# Altium schematic sheet [12] - CAN & RS232.SchDoc: CAN & RS232
size B; Organization: Altium Limited; Address1: L3, 12a Rodborough Rd; Address2: Frenchs Forest; Address3: NSW; Address4: Australia 2086; DocumentNumber: 12; Revision: V1I1; SheetNumber: 12; SheetTotal: 16
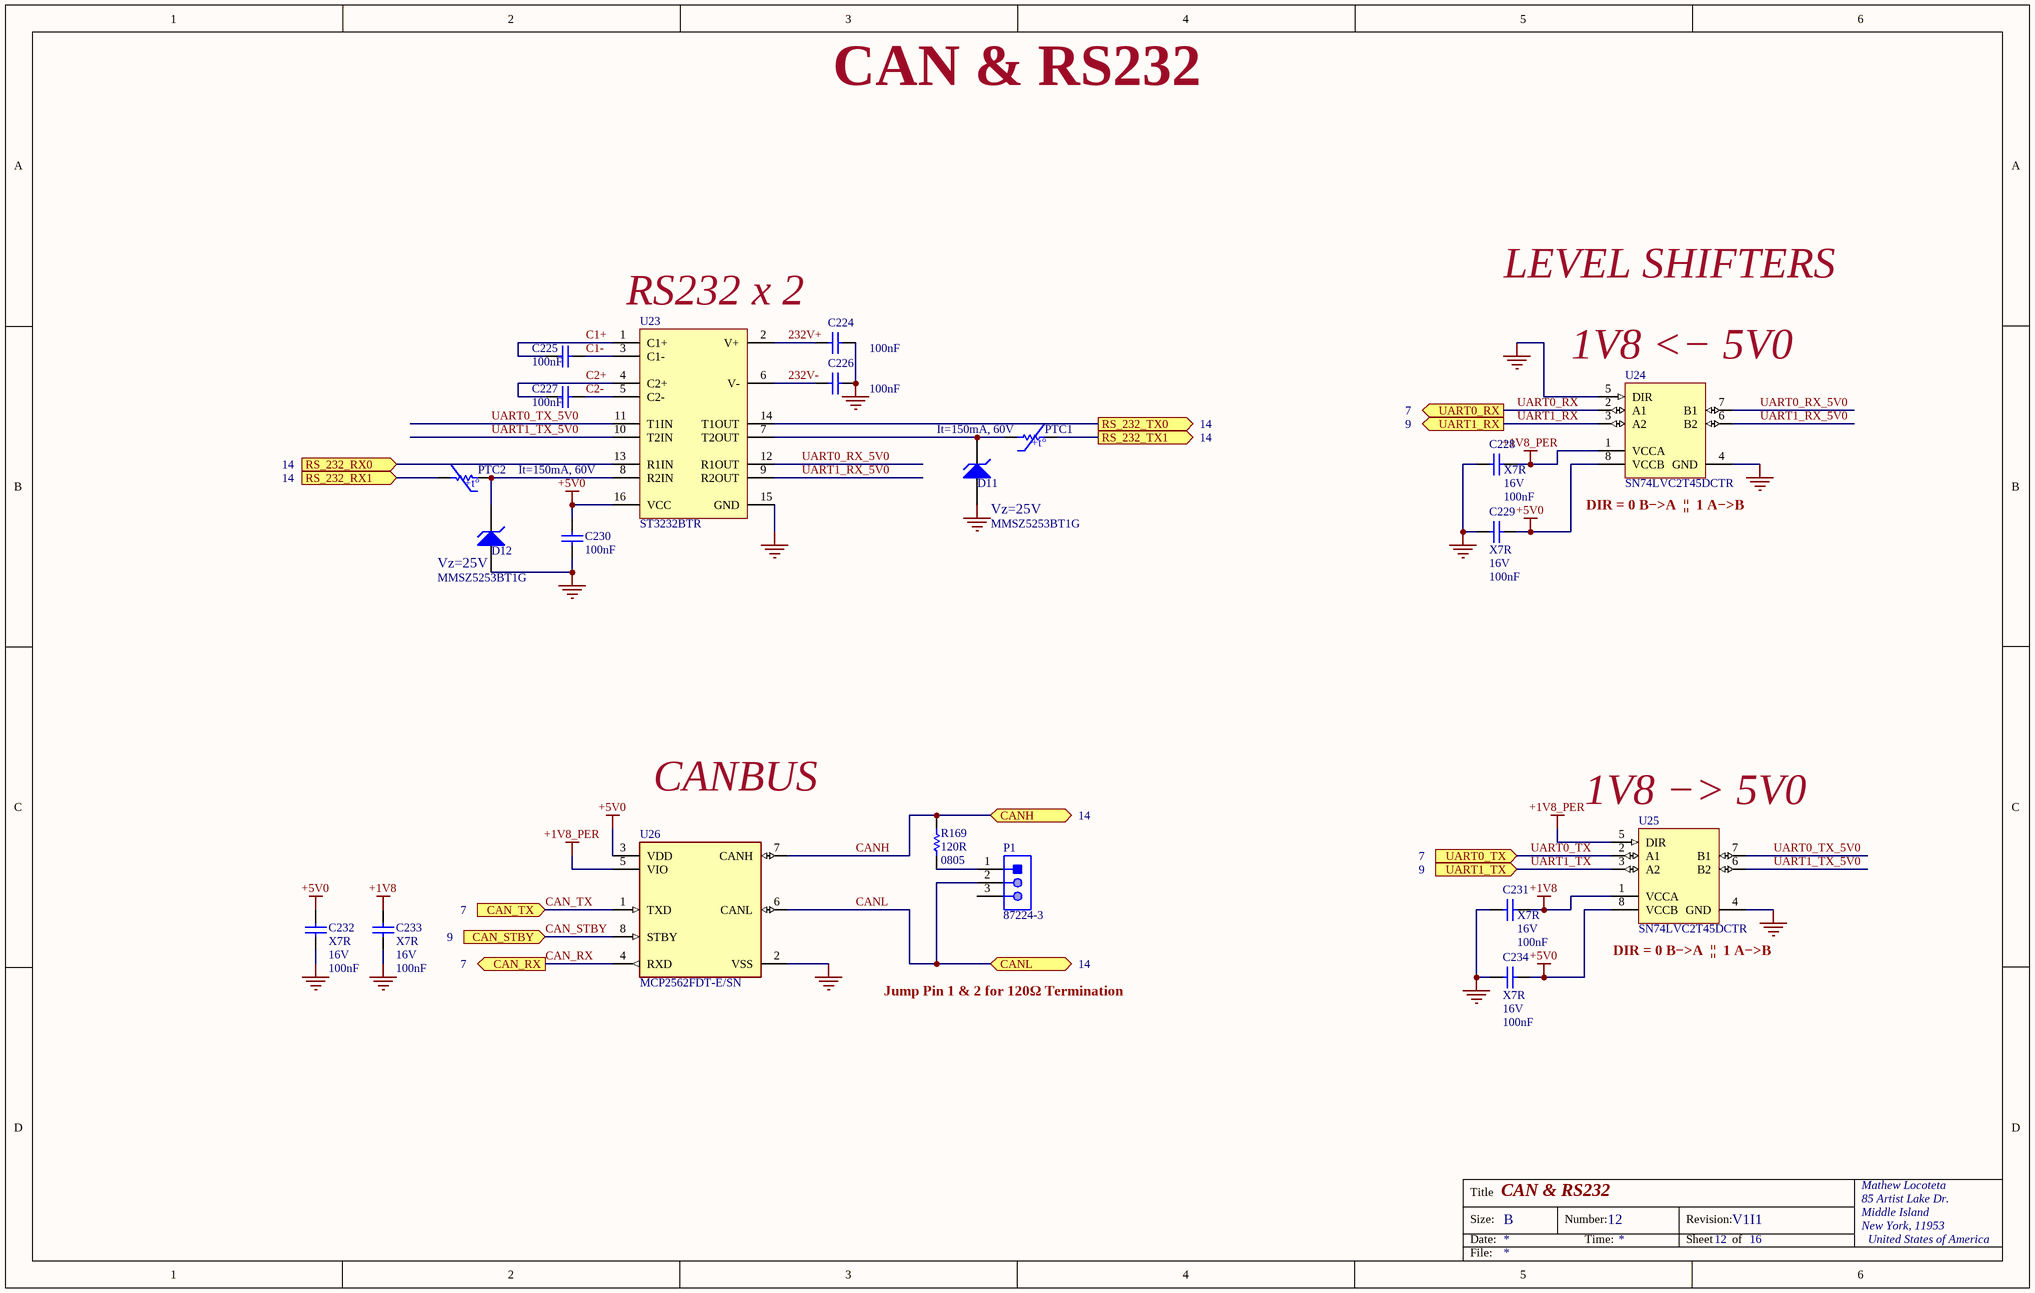
[diagram p0: [12] - CAN & RS232.SchDoc]

## Parts
C224  Capacitance: 100nF  (hidden comment: 100nF 0402 16V)
C225  Capacitance: 100nF  (hidden comment: 100nF 0402 16V)
C226  Capacitance: 100nF  (hidden comment: 100nF 0402 16V)
C227  Capacitance: 100nF  (hidden comment: 100nF 0402 16V)
C228  Dielectric: X7R  Voltage Rating: 16V  Capacitance: 100nF  (hidden comment: 100nF 0402 16V)
C229  Dielectric: X7R  Voltage Rating: 16V  Capacitance: 100nF  (hidden comment: 100nF 0402 16V)
C230  Capacitance: 100nF  (hidden comment: 100nF 0402 16V)
C231  Dielectric: X7R  Voltage Rating: 16V  Capacitance: 100nF  (hidden comment: 100nF 0402 16V)
C232  Dielectric: X7R  Voltage Rating: 16V  Capacitance: 100nF  (hidden comment: 100nF 0402 16V)
C233  Dielectric: X7R  Voltage Rating: 16V  Capacitance: 100nF  (hidden comment: 100nF 0402 16V)
C234  Dielectric: X7R  Voltage Rating: 16V  Capacitance: 100nF  (hidden comment: 100nF 0402 16V)
D11  MMSZ5253BT1G  [ONSC-SOD-123-2-425-04_V]
D12  MMSZ5253BT1G  [ONSC-SOD-123-2-425-04_V]
P1  87224-3  [TECO-87224-3_V]
PTC1  It=150mA, 60V  [R1206]
PTC2  It=150mA, 60V  [R1206]
R169  value 120R  Case: 0805  [RESC2013X50X30LL20T20]  (hidden comment: CRCW0805120RJNEA)
U23  ST3232BTR  [STM-TSSOP-16_L]
U24  SN74LVC2T45DCTR  [DCT0008A_N]
U25  SN74LVC2T45DCTR  [DCT0008A_N]
U26  MCP2562FDT-E/SN  [FP-C04-057-SN-MFG]

## Ports
CAN_RX (out), CAN_STBY (in), CAN_TX (in), CANH (bidir), CANL (bidir), RS_232_RX0 (in), RS_232_RX1 (in), RS_232_TX0 (out), RS_232_TX1 (out), UART0_RX (out), UART0_TX (in), UART1_RX (out), UART1_TX (in)

## Nets
+1V8: C231.1 C233.2 U25.1(VCCA)
+1V8_PER: C228.1 U24.1(VCCA) U25.5(DIR) U26.5(VIO)
+5V0: C229.2 C230.2 C232.2 C234.2 U23.16(VCC) U24.8(VCCB) U25.8(VCCB) U26.3(VDD)
GND: C224.1 C226.1 C228.2 C229.1 C230.1 C231.2 C232.1 C233.1 C234.1 D11.2(A) D12.2(A) U23.15(GND) U24.4(GND) U24.5(DIR) U25.4(GND) U26.2(VSS)
232V+: C224.2 U23.2(V+)
232V-: C226.2 U23.6(V-)
C1+: C225.1 U23.1(C1+)
C1-: C225.2 U23.3(C1-)
C2+: C227.1 U23.4(C2+)
C2-: C227.2 U23.5(C2-)
CAN_RX: U26.4(RXD) ; port CAN_RX
CAN_STBY: U26.8(STBY) ; port CAN_STBY
CAN_TX: U26.1(TXD) ; port CAN_TX
CANH: R169.1 U26.7(CANH) ; port CANH
CANL: P1.2 U26.6(CANL) ; port CANL
RS_232_RX0: U23.13(R1IN) ; port RS_232_RX0
RS_232_RX1: PTC2.2 ; port RS_232_RX1
RS_232_TX0: U23.14(T1OUT) ; port RS_232_TX0
RS_232_TX1: PTC1.2 ; port RS_232_TX1
UART0_RX: U24.2(A1) ; port UART0_RX
UART0_RX_5V0: U23.12(R1OUT) U24.7(B1)
UART0_TX: U25.2(A1) ; port UART0_TX
UART0_TX_5V0: U23.11(T1IN) U25.7(B1)
UART1_RX: U24.3(A2) ; port UART1_RX
UART1_RX_5V0: U23.9(R2OUT) U24.6(B2)
UART1_TX: U25.3(A2) ; port UART1_TX
UART1_TX_5V0: U23.10(T2IN) U25.6(B2)
NetD11_1: D11.1(K) PTC1.1 U23.7(T2OUT)
NetD12_1: D12.1(K) PTC2.1 U23.8(R2IN)
NetP1_1: P1.1 R169.2

Not connected (* = marked no-connect by the designer): P1 3

## Notes on the sheet
- CAN & RS232
- LEVEL SHIFTERS
- RS232 x 2
- (near U24) 1V8 <− 5V0
- 14
- 7
- 9
- (near U24) DIR = 0 B−>A  ||  1 A−>B
- (near D12) Vz=25V
- (near D11) Vz=25V
- CANBUS
- (near U25) 1V8 −> 5V0
- (near U25) DIR = 0 B−>A  ||  1 A−>B
- Jump Pin 1 & 2 for 120Ω Termination
- Title
- Size:
- Date:
- B
- Number:
- Time:
- Revision:
- Sheet
- of
- Mathew Locoteta
- 85 Artist Lake Dr.
- Middle Island
- New York, 11953
- United States of America
- File:
- (in symbol 0ZCJ0005FF2E) +t°

## Library data of the parts
C224-C234 = C0402C104J4RACTU: KEMET - C0402C104J4RACTU - SMD Multilayer Ceramic Capacitor, 0.1 µF, 16 V, 0402 [1005 Metric], ± 5%, X7R, C Series KEMET; Dissipation Factor: 3.5%; Supplier 1: Digi-Key; Manufacturer: KEMET; Manufacturer Part Number: C0402C104J4RACTU; RoHS: Yes; Category: Ceramic Capacitors; Stock 1: 106350; Pricing 1: 1=0.48000, 10=0.33900, 50=0.25620, 100=0.22310, 500=0.16528, 1000=0.14049, 2500=0.13223, 5000=0.12396 (USD); Mount: Surface Mount,PCB; Case/Package: 0402; Case Code (Metric): 1005; Case Code (Imperial): 0402; Dielectric Material: Ceramic; Contact Plating: Tin,Matte; Min Operating Temperature: -55°C; Max Operating Temperature: 125°C; Tolerance: 5%; Packaging: Tape and Reel; Package Quantity: 1; Termination: SMD/SMT; Voltage: 16V; Length: 1mm; Height: 0.5mm; Width: 0.02inch; Thickness: 0.022inch; Depth: 0.5mm; Radiation Hardening: No; REACH SVHC: No SVHC; ComponentLink1URL: https://datasheet.ciiva.com/5415/kem-c1002-x7r-smd-5415819.pdf?src-supplier=Mouser; ComponentLink1Description: https://datasheet.ciiva.com/5415/kem-c1002-x7r-smd-5415819.pdf?src-supplier=Mouser; ComponentLink2URL: https://datasheet.ciiva.com/46424/1851736-46424159.pdf?src-supplier=Element14; ComponentLink2Description: https://datasheet.ciiva.com/46424/1851736-46424159.pdf?src-supplier=Element14; Supplier Part Number 1: 399-7761-1-ND; Voltage Rating (DC): 16V
  C224-C227 C230: Dielectric: X7R; Voltage Rating: 16V
D11 D12 = CMP-1060-00460-1: Zener Voltage Regulator, 500 mW, 2-Pin SOD-123, Pb-Free, Tape and Reel; Manufacturer: On Semiconductor; P Max (W): 0.5; VZ Typ (V): 25; PackageVersion: Rev. G, 10/2009; RoHS: Pb-Free; PartNumber: MMSZ5253BT1G; DatasheetVersion: Rev. 12; PackageReference: SOD-123-2-425-04; ComponentLink2Description: Datasheet; Mounting Technology: Surface Mount; ComponentLink2URL: http://www.onsemi.com/pub_link/Collateral/MMSZ5221BT1-D.PDF; ComponentLink1Description: Manufacturer URL; ComponentLink3Description: Package Specification; ComponentLink3URL: http://www.onsemi.com/pub_link/Collateral/425-04.PDF; Packing: Tape and Reel; ComponentLink1URL: http://www.onsemi.com/; PackageDescription: 2-Pin SOD, Body 1.6 x 2.69 mm
P1 = CMP-2000-05697-1: Male Header, Pitch 2.54 mm, 1 x 3 Position, Height 10.744 mm, Tail Length 3.175 mm, -65 to 105 degC, RoHS, Bulk; Manufacturer: TE Connectivity; Catalog Drawings: SingleSquareStraightPost / SingleSquareStraightPostSide; Connector Type: Header,Unshrouded; Pitch: 0.100"(2.54mm); Mating Products: 147738-2-ND / -CONNRCPT3POSVERTSMDGOLD / 147723-2-ND / -CONNRCPT3POSVERT.100GOLD / 146763-5-ND / -CONNRCPT3POSSGLVERT.100T/H / A32904-ND / -CONNRECEPT3POS.100VERTGOLD / A26922-ND / -CONNHOUSING3POS.100LOCKING / A26415-ND / -CONNRECEPT3POS.100VERTAU / A26964-ND / -CONNHOUSING3POS.100SINGLE / A3012-ND / -CONNHOUSING3POS.100SINGLE; Number of Positions Loaded: All; Featured Product: AMPMODUConnectors; Dynamic Catalog: AMPMODUModIISeries; 3D Model: 87224-3.pdf; Other Names: 87224-3-ND / A26545; Number of Positions: 3; RoHS Information: 87224-3StatementofCompliance; Termination: Solder; Datasheet URL: http://www.te.com/commerce/DocumentDelivery/DDEController?Action=showdoc&DocId=Customer+Drawing%7F87224%7FL3%7Fpdf%7FEnglish%7FENG_CD_87224_L3.pdf%7F87224-3; Category: Connectors,Interconnects; Contact Mating Length: 0.318"(8.08mm); Standard Package: 520; Mounting Type: ThroughHole; Family: RectangularConnectors-Headers,MalePins; Number of Rows: 1; Series: AMPMODUModII; Contact Finish Thickness: 15µin(0.38µm); Datasheet Version: Rev. L3, 08/2015; Package Reference: 87224-3; Mounting Technology: ThroughHole; Manufacturer URL: http://www.te.com/; Contact Type: MalePin; Packaging: Bulk; Color: Black; Package Description: Male Header, Pitch 2.54 mm, 1 x 3 Position, Height 10.744 mm, Tail Length 3.175 mm; Contact Finish: Gold
PTC1 PTC2 = 0ZCJ0005FF2E: PTC RESET FUSE 60V 50MA 1206; Manufacturer: Bel; Max Current Rating: 10A; Power Dissipation: 400mW; Trip Current: 150mA; Time to Trip: 1.5s; Approvals: UL,TUV; Supplier 1: Digi-Key; Manufacturer Part Number: 0ZCJ0005FF2E; RoHS: Yes; Category: Fuses; Stock 1: 295306; Pricing 1: 1=0.13000, 5=0.13000, 10=0.12500, 50=0.11140, 100=0.10370, 250=0.09216, 500=0.07680, 1000=0.07296 (USD); Mount: Surface Mount; Case/Package: 1206; Case Code (Metric): 3216; Case Code (Imperial): 1206; Contact Plating: Tin,Matte; Number of Terminals: 2; Min Operating Temperature: -40°C; Max Operating Temperature: 85°C; Package Quantity: 1; Packaging: Tape and Reel; Max Voltage Rating (DC): 60V; Hold Current: 50mA; Lead Free: Lead Free; ComponentLink1URL: https://datasheet.ciiva.com/18550/0zcj-18550517.pdf?src-supplier=Digi-Key; ComponentLink1Description: https://datasheet.ciiva.com/18550/0zcj-18550517.pdf?src-supplier=Digi-Key; ComponentLink2URL: https://datasheet.ciiva.com/18550/0zcj-18550518.pdf?src-supplier=Digi-Key; ComponentLink2Description: https://datasheet.ciiva.com/18550/0zcj-18550518.pdf?src-supplier=Digi-Key; ComponentLink3URL: https://datasheet.ciiva.com/18550/0zcj-18550519.pdf?src-supplier=Digi-Key; ComponentLink3Description: https://datasheet.ciiva.com/18550/0zcj-18550519.pdf?src-supplier=Digi-Key; Supplier Part Number 1: 507-1793-1-ND
R169 = CMP-2001-04288-1: Manufacturer: Vishay Dale; Part Number: CRCW0805120RJNEA
U23 = CMP-2000-07155-1: RS-232 Driver and Receiver, 3 to 5.5 V, -40 to 85 degC, 16-Pin TSSOP, RoHS, Tape and Reel; Manufacturer: STMicroelectronics; Dual Supply Voltage (Min): NotRequiredV; Power Supply Requirement: Single; Receiver Signal Type: Single-Ended; Number of Transmitters: 2; Single Supply Voltage (Typ): 3.3/5V; Supply Current: 2mA; Single Supply Voltage (Min): 3V; DELETED: Compliant; Data Rate: 0.4kbps; Number of Transceivers: 1; Rad Hardened: No; Single Supply Voltage (Max): 5.5V; Data Transmission Topology: Point-to-Point; Datasheet URL: http://www.st.com/content/ccc/resource/technical/document/datasheet/group1/40/2c/7f/62/3a/3f/47/3c/CD00002253/files/CD00002253.pdf/jcr:content/translations/en.CD00002253.pdf; Dual Supply Voltage (Max): NotRequiredV; Packaging: TapeandReel; Mounting Technology: SurfaceMount; Package Reference: TSSOP-16; Operating Temperature Classification: Industrial; Package Description: 16-Pin Thin Shrink Small Outline Package, Body 5 x 4.4 mm, Pitch 0.65 mm; Operating Temp Range: -40Cto85C; Manufacturer URL: http://www.st.com/; Datasheet Version: Rev. 12, 01/2016; Mounting: SurfaceMount; Dual Supply Voltage (Typ): NotRequiredV; Pin Count: 16; Number of Receivers: 2; Package Type: TSSOP; Interface Circuit Standard 1: RS-232; Transmitter Signal Type: Single-Ended
U24 U25 = CMP-0859-00006-4: Dual-Bit Dual Supply Transceiver with Configurable Voltage Translation and 3-State Outputs, DCT0008A, LARGE T&R; Manufacturer: Texas Instruments; Rating: Military; Input Type: CMOS/TTL; Schmitt Trigger: No; ICC @ Nom Voltage(Max)(mA): 0.004; Bits(#): 2; Logic: True; tpd @ Nom Voltage(Max)(ns): 17.7,10.3,8.3,7.2; VCC(Min)(V): 1.65; Voltage(Nom)(V): 1.8,2.5,3.3,5; Output Type: CMOS; F @ Nom Voltage(Max)(Mhz): 150; Technology Family: LVC; VCC(Max)(V): 5.5; Output Drive (IOL/IOH)(Max)(mA): 32/-32; 3-State Output: Yes; Sub-Family: Dual Supply Translator; Operating Temperature Range(C): -40 to 85; DatasheetVersion: SCES516J; Generic Part Number: SN74LVC2T45; PackageReference: DCT0008A
U26 = CMP-06279-000005-1: IC TRANSCEIVER 1/1 8SOIC; Operating Supply Current: 70mA; Data Rate: 8Mbps; Number of Transceivers: 1; Receiver Hysteresis: 200mV; Max Supply Voltage: 5.5V; Min Supply Voltage: 4.5V; Weight: 0.019048oz; Package Quantity: 3300; Case/Package: SOIC; Mount: Surface Mount; Max Operating Temperature: 125°C; Min Operating Temperature: -40°C; Packaging: Tape and Reel; Number of Pins: 8